# EAGLE schematic EEZ DIB SMX46 r1B5 (EAGLE 7.2.0)
ADIB
Assembly variants: Farnell, TME

## Sheet 1 of 3: DIB interface
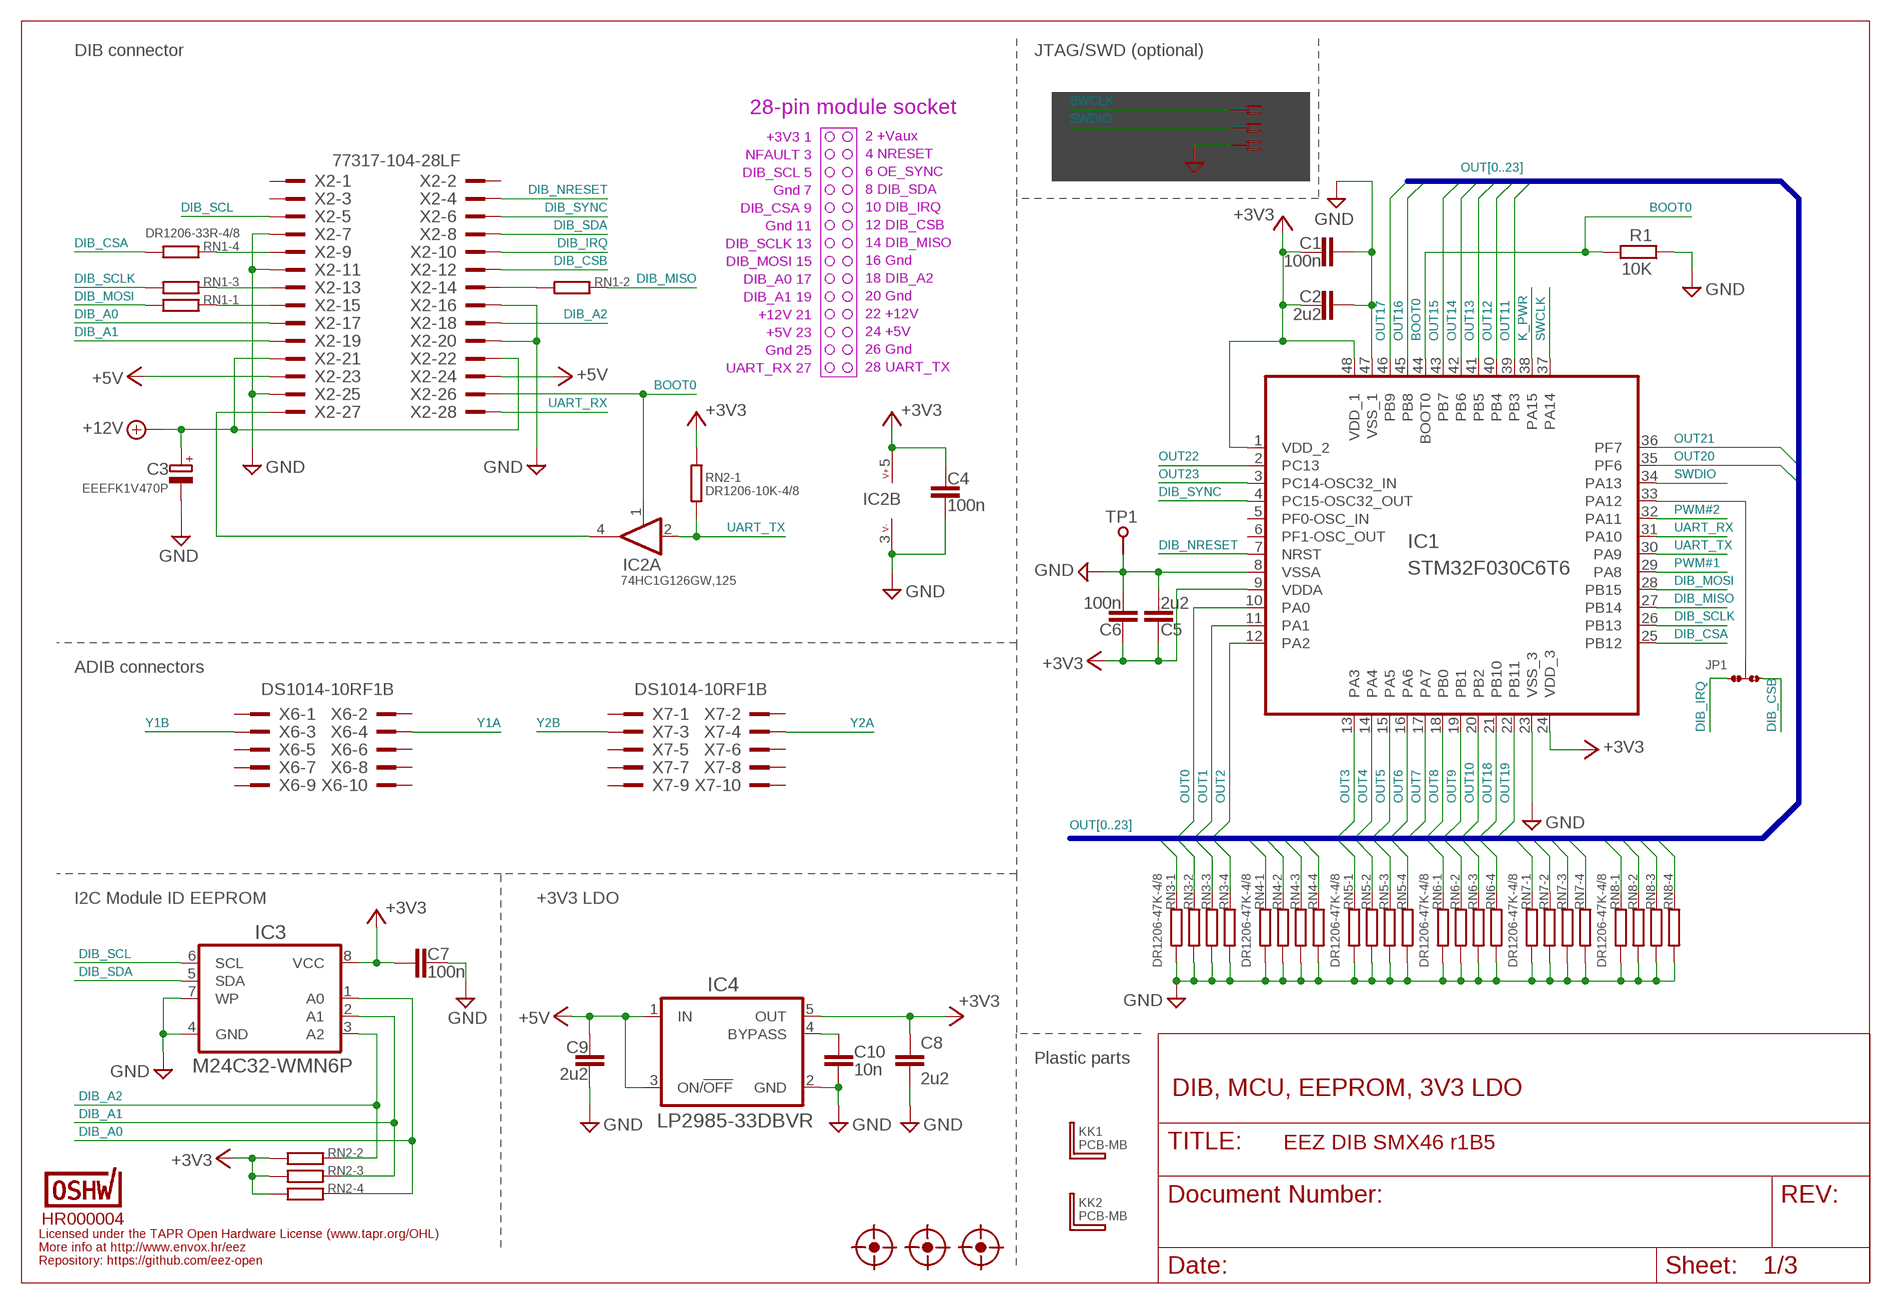
[diagram p0: schematic, sheet 1]

### Parts
C1  100n  C-EUC0603  [C0603]
C2  2u2  C-EUC0805  [C0805]
C3  EEEFK1V470P  ECAPPANASONIC_H  [CAPAE660X610N]
C4  100n  C-EUC0603  [C0603]
C5  2u2  C-EUC0805  [C0805]
C6  100n  C-EUC0603  [C0603]
C7  100n  C-EUC0603  [C0603]
C8  2u2  C-EUC0805  [C0805]
C9  2u2  C-EUC0805  [C0805]
C10  10n  C-EUC0805  [C0805]
FM1  FIDUCIAL_2  [FIDUCIAL_DUAL]
FM2  FIDUCIAL_2  [FIDUCIAL_DUAL]
FM3  FIDUCIAL_2  [FIDUCIAL_DUAL]
IC1  STM32F030C6T6  [LQFP-48]
IC2  74HC1G126GW,125  [SOT65P210X110-5N]
IC3  M24C32-WMN6P  AT24CXXSOIC8  [SOIC127P600X173-8N]
IC4  LP2985-33DBVR  LP2985  [SOT95P270X145-5N]
JP1  JP3-CUT-0805-ROTATED  [JP3-0805-CUT2]
KK1  PCB-MB  [PCB-MB]
KK2  PCB-MB  [PCB-MB]
R1  10K  R-EU_R0805  [R0805]
RN1  DR1206-33R-4/8  R_ARRAY4  [CAY16]
RN2  DR1206-10K-4/8  R_ARRAY4  [CAY16]
RN3  DR1206-47K-4/8  R_ARRAY4  [CAY16]
RN4  DR1206-47K-4/8  R_ARRAY4  [CAY16]
RN5  DR1206-47K-4/8  R_ARRAY4  [CAY16]
RN6  DR1206-47K-4/8  R_ARRAY4  [CAY16]
RN7  DR1206-47K-4/8  R_ARRAY4  [CAY16]
RN8  DR1206-47K-4/8  R_ARRAY4  [CAY16]
TP1  PCB_TEST_TABSHIELD  [PCB_SHIELD_TAB]
U$3  HR000004  CERT-SMALL  [CERT-SMALL-SILK]
X1  N.C.  SSW-106-02-S-S  [SSW-106-02-S-S]
X2  77317-104-28LF  [77317-104-28LF]
X6  DS1014-10RF1B  [DS1014-10RF1B]
X7  DS1014-10RF1B  [DS1014-10RF1B]

### Nets
+3V3: C1.2 C2.1 C4.1 C5.2 C6.1 C7.2 C8.1 IC1.1(VDD_2) IC1.9(VDDA) IC1.24(VDD_3) IC1.48(VDD_1) IC2.5(B:V+) IC3.8(VCC) IC4.5(OUT) RN2.5 RN2.6 RN2.7 RN2.8 ; also sheet 2
+5V: C9.2 IC4.1(IN) IC4.3(ON/!OFF) X2.23 X2.24 ; also sheet 2
+12V: C3.1(+) X2.21 X2.22 ; also sheet 2,3
BOOT0: IC1.44(BOOT0) IC2.1(A:EN) R1.2 X2.26
DIB_A0: IC3.1(A0) RN2.4 X2.17
DIB_A1: IC3.2(A1) RN2.3 X2.19
DIB_A2: IC3.3(A2) RN2.2 X2.18
DIB_CSA: IC1.25(PB12) RN1.4
DIB_CSB: JP1.NO X2.12
DIB_IRQ: JP1.NC X2.10
DIB_MISO: IC1.27(PB14) RN1.2
DIB_MOSI: IC1.28(PB15) RN1.1
DIB_NRESET: IC1.7(NRST) X2.4
DIB_SCL: IC3.6(SCL) X2.5
DIB_SCLK: IC1.26(PB13) RN1.3
DIB_SDA: IC3.5(SDA) X2.8
DIB_SYNC: IC1.4(PC15-OSC32_OUT) X2.6
GND: C1.1 C2.2 C3.2(-) C4.2 C5.1 C6.2 C7.1 C8.2 C9.1 C10.1 IC1.8(VSSA) IC1.23(VSS_3) IC1.47(VSS_1) IC2.3(B:V-) IC3.4(GND) IC3.7(WP) IC4.2(GND) R1.1 RN3.1 RN3.2 RN3.3 RN3.4 RN4.1 RN4.2 RN4.3 RN4.4 RN5.1 RN5.2 RN5.3 RN5.4 RN6.1 RN6.2 RN6.3 RN6.4 RN7.3 RN7.4 RN7.7 RN7.8 RN8.3 RN8.4 RN8.7 RN8.8 TP1.1 X1.3 X2.7 X2.11 X2.16 X2.20 X2.25 ; also sheet 2,3
K_PWR: IC1.38(PA15) ; also sheet 2
N$69: RN1.5 X2.9
N$70: C10.2 IC4.4(BYPASS)
N$72: IC2.4(A:O) X2.27
N$75: IC1.33(PA12) JP1.COM
N$99: RN1.6 X2.13
N$101: RN1.7 X2.14
N$102: RN1.8 X2.15
OUT0: IC1.10(PA0) RN3.8 ; also sheet 3
OUT1: IC1.11(PA1) RN3.7 ; also sheet 3
OUT2: IC1.12(PA2) RN6.8 ; also sheet 3
OUT3: IC1.13(PA3) RN6.7 ; also sheet 3
OUT4: IC1.14(PA4) RN3.5 ; also sheet 3
OUT5: IC1.15(PA5) RN3.6 ; also sheet 3
OUT6: IC1.16(PA6) RN6.5 ; also sheet 3
OUT7: IC1.17(PA7) RN6.6 ; also sheet 3
OUT8: IC1.18(PB0) RN4.7 ; also sheet 3
OUT9: IC1.19(PB1) RN4.8 ; also sheet 3
OUT10: IC1.20(PB2) RN7.6 ; also sheet 3
OUT11: IC1.39(PB3) RN7.5 ; also sheet 3
OUT12: IC1.40(PB4) RN4.5 ; also sheet 3
OUT13: IC1.41(PB5) RN4.6 ; also sheet 3
OUT14: IC1.42(PB6) RN7.2 ; also sheet 3
OUT15: IC1.43(PB7) RN7.1 ; also sheet 3
OUT16: IC1.45(PB8) RN5.7 ; also sheet 3
OUT17: IC1.46(PB9) RN5.8 ; also sheet 3
OUT18: IC1.21(PB10) RN8.5 ; also sheet 3
OUT19: IC1.22(PB11) RN8.6 ; also sheet 3
OUT20: IC1.35(PF6) RN5.5 ; also sheet 3
OUT21: IC1.36(PF7) RN5.6 ; also sheet 3
OUT22: IC1.2(PC13) RN8.1 ; also sheet 3
OUT23: IC1.3(PC14-OSC32_IN) RN8.2 ; also sheet 3
PWM#1: IC1.29(PA8) ; also sheet 2
PWM#2: IC1.32(PA11) ; also sheet 2
SWCLK: IC1.37(PA14) X1.2
SWDIO: IC1.34(PA13) X1.4
UART_RX: IC1.31(PA10) X2.28
UART_TX: IC1.30(PA9) IC2.2(A:I) RN2.1
Y1A: X6.4 ; also sheet 2
Y1B: X6.3 ; also sheet 2
Y2A: X7.4 ; also sheet 2
Y2B: X7.3 ; also sheet 2
Unconnected: IC1.5(PF0-OSC_IN) IC1.6(PF1-OSC_OUT) X1.1 X1.5 X1.6 X2.1 X2.2 X2.3 X6.1 X6.2 X6.5 X6.6 X6.7 X6.8 X6.9 X6.10 X7.1 X7.2 X7.5 X7.6 X7.7 X7.8 X7.9 X7.10

### Buses
OUT[0..23]

### Notes on the sheet
- DIB connector | JTAG/SWD (optional)
- 28-pin module socket
- +3V3 1
- 2 +Vaux
- NFAULT 3
- 4 NRESET
- DIB_SCL 5
- 6 OE_SYNC
- Gnd 7
- 8 DIB_SDA
- DIB_CSA 9
- 10 DIB_IRQ
- Gnd 11
- 12 DIB_CSB
- DIB_SCLK 13
- 14 DIB_MISO
- DIB_MOSI 15
- 16 Gnd
- DIB_A0 17
- 18 DIB_A2
- DIB_A1 19
- 20 Gnd
- +12V 21
- 22 +12V
- +5V 23
- 24 +5V
- Gnd 25
- 26 Gnd
- UART_RX 27
- 28 UART_TX
- ADIB connectors
- I2C Module ID EEPROM | +3V3 LDO
- Plastic parts
- DIB, MCU, EEPROM, 3V3 LDO
- Licensed under the TAPR Open Hardware License (www.tapr.org/OHL)
- More info at http://www.envox.hr/eez
- Repository: https://github.com/eez-open

## Sheet 2 of 3
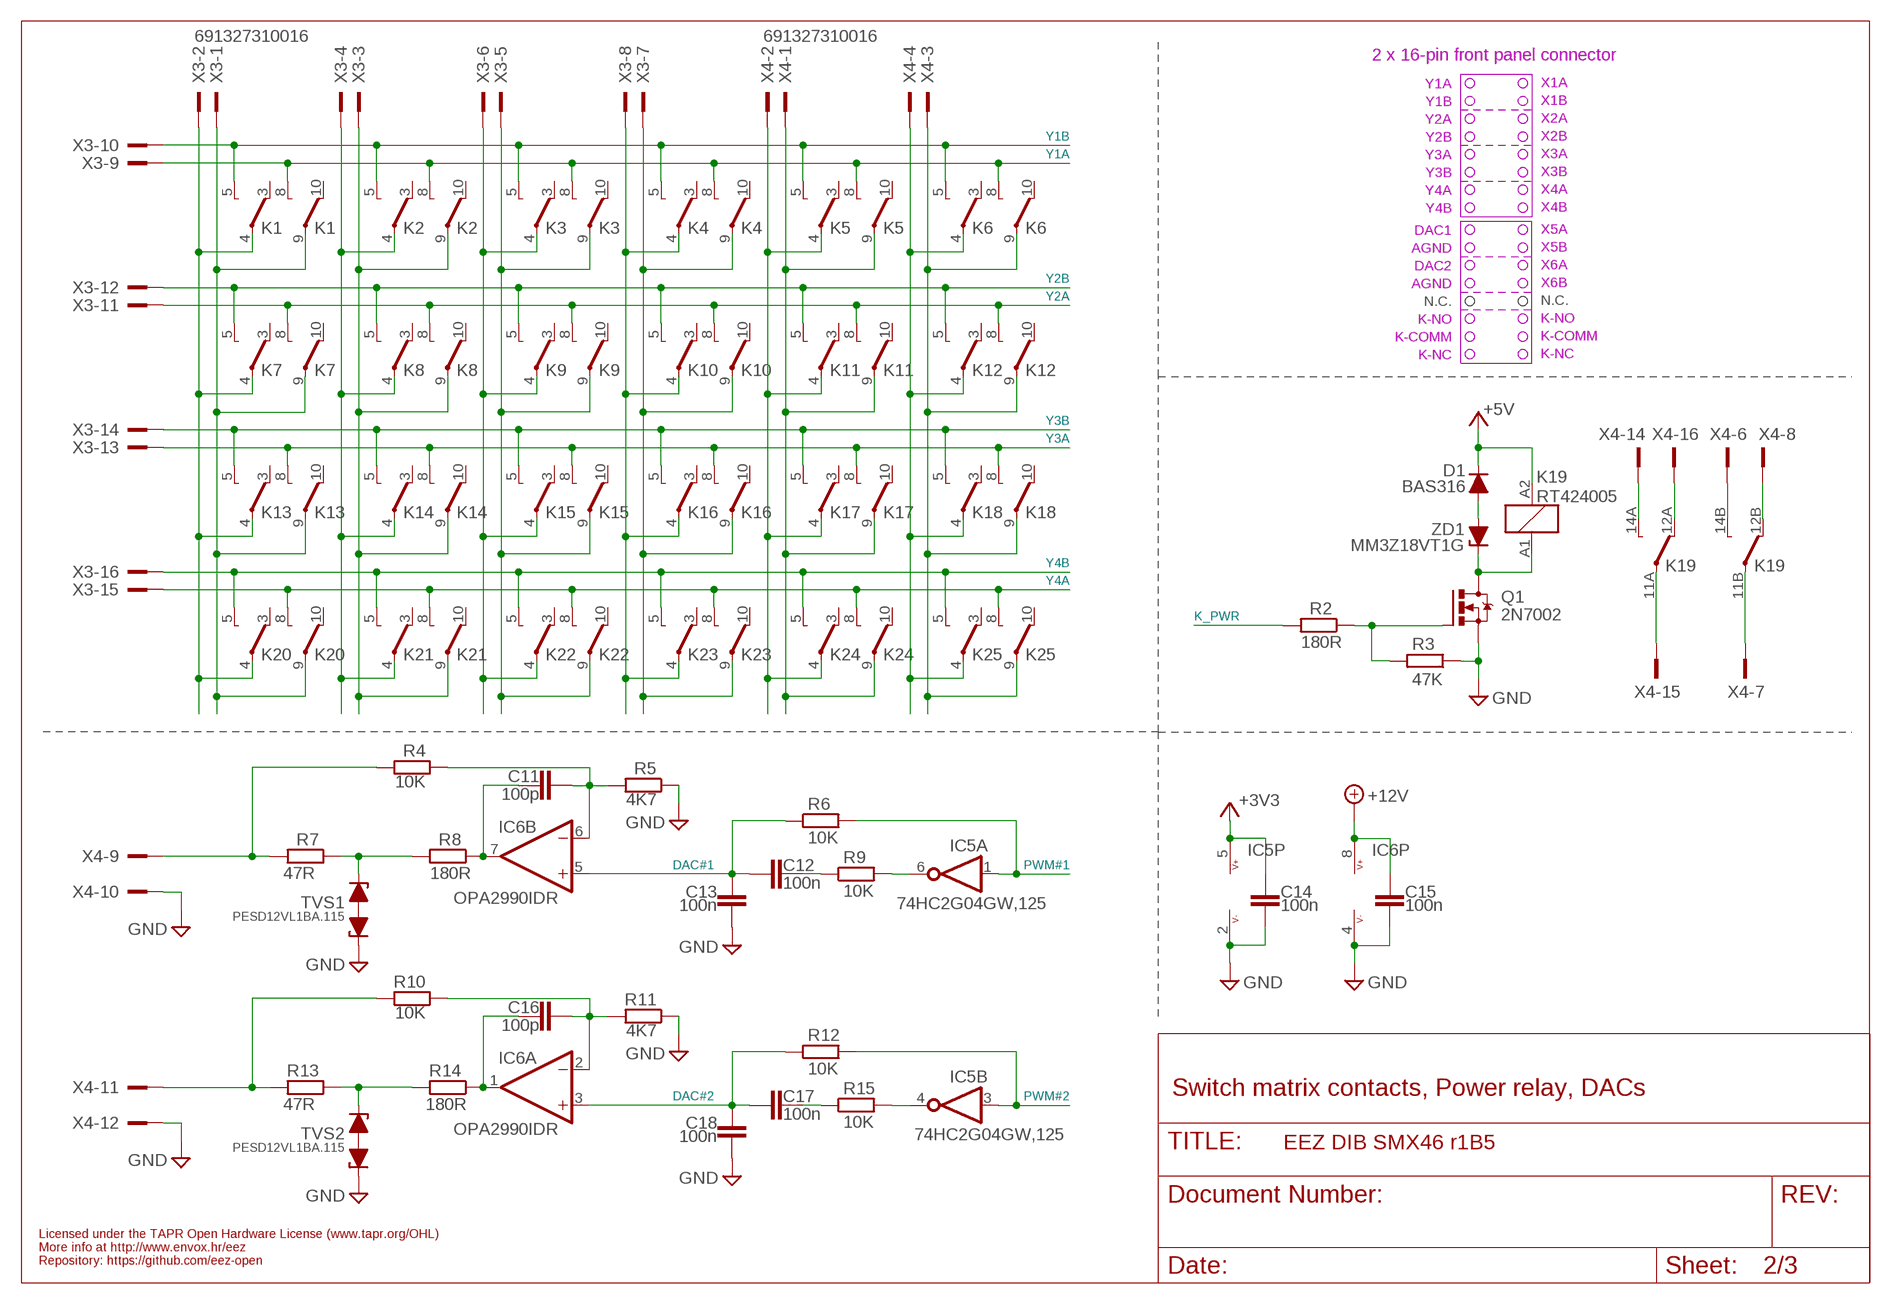
[diagram p1: schematic, sheet 2]

### Parts
C11  100p  C-EUC0805  [C0805]
C12  100n  C-EUC0603  [C0603]
C13  100n  C-EUC0603  [C0603]
C14  100n  C-EUC0603  [C0603]
C15  100n  C-EUC0603  [C0603]
C16  100p  C-EUC0805  [C0805]
C17  100n  C-EUC0603  [C0603]
C18  100n  C-EUC0603  [C0603]
D1  BAS316  DIODESOD323R  [SOD323-R]
IC5  74HC2G04GW,125  74HC2G04  [SOT65P210X110-6N]
IC6  OPA2990IDR  TL072SOIC8  [SOIC127P600X173-8N]
K1  FTR-C1GA012G-B05  FTR-C1  [FTR-C1]
K2  FTR-C1GA012G-B05  FTR-C1  [FTR-C1]
K3  FTR-C1GA012G-B05  FTR-C1  [FTR-C1]
K4  FTR-C1GA012G-B05  FTR-C1  [FTR-C1]
K5  FTR-C1GA012G-B05  FTR-C1  [FTR-C1]
K6  FTR-C1GA012G-B05  FTR-C1  [FTR-C1]
K7  FTR-C1GA012G-B05  FTR-C1  [FTR-C1]
K8  FTR-C1GA012G-B05  FTR-C1  [FTR-C1]
K9  FTR-C1GA012G-B05  FTR-C1  [FTR-C1]
K10  FTR-C1GA012G-B05  FTR-C1  [FTR-C1]
K11  FTR-C1GA012G-B05  FTR-C1  [FTR-C1]
K12  FTR-C1GA012G-B05  FTR-C1  [FTR-C1]
K13  FTR-C1GA012G-B05  FTR-C1  [FTR-C1]
K14  FTR-C1GA012G-B05  FTR-C1  [FTR-C1]
K15  FTR-C1GA012G-B05  FTR-C1  [FTR-C1]
K16  FTR-C1GA012G-B05  FTR-C1  [FTR-C1]
K17  FTR-C1GA012G-B05  FTR-C1  [FTR-C1]
K18  FTR-C1GA012G-B05  FTR-C1  [FTR-C1]
K19  RT424005  RELAY_RT314012-2  [RT-C/016A5_ROUND]
K20  FTR-C1GA012G-B05  FTR-C1  [FTR-C1]
K21  FTR-C1GA012G-B05  FTR-C1  [FTR-C1]
K22  FTR-C1GA012G-B05  FTR-C1  [FTR-C1]
K23  FTR-C1GA012G-B05  FTR-C1  [FTR-C1]
K24  FTR-C1GA012G-B05  FTR-C1  [FTR-C1]
K25  FTR-C1GA012G-B05  FTR-C1  [FTR-C1]
Q1  2N7002  [SOT103P240X110-3N]
R2  180R  R-EU_R0805  [R0805]
R3  47K  R-EU_R0805  [R0805]
R4  10K  R-EU_R0805  [R0805]
R5  4K7  R-EU_R0805  [R0805]
R6  10K  R-EU_R0805  [R0805]
R7  47R  R-EU_R0805  [R0805]
R8  180R  R-EU_R0805  [R0805]
R9  10K  R-EU_R0805  [R0805]
R10  10K  R-EU_R0805  [R0805]
R11  4K7  R-EU_R0805  [R0805]
R12  10K  R-EU_R0805  [R0805]
R13  47R  R-EU_R0805  [R0805]
R14  180R  R-EU_R0805  [R0805]
R15  10K  R-EU_R0805  [R0805]
TVS1  PESD12VL1BA.115  PESDXL1BA  [SOD323-BIDIR]
TVS2  PESD12VL1BA.115  PESDXL1BA  [SOD323-BIDIR]
X3  691327310016  [691327310016]
X4  691327310016  [691327310016]
ZD1  MM3Z18VT1G  ZENER-DIODESOD323R  [SOD323-R]

### Nets
+3V3: C14.1 IC5.5(P:V+) ; also sheet 1
+5V: D1.C K19.A2(K:C1) ; also sheet 1
+12V: C15.1 IC6.8(P:V+) ; also sheet 1,3
DAC#1: C12.1 C13.1 IC6.5(B:+IN) R6.1
DAC#2: C17.1 C18.1 IC6.3(A:+IN) R12.1
GND: C13.2 C14.2 C15.2 C18.2 IC5.2(P:V-) IC6.4(P:V-) Q1.2(S) R3.1 R5.1 R11.1 TVS1.1 TVS2.1 X4.10 X4.12 ; also sheet 1,3
ISET1: R7.1 R8.2 TVS1.2
ISET2: R13.1 R14.2 TVS2.2
K_PWR: R2.2 ; also sheet 1
N$1: K1.4(-1:P) K7.4(-1:P) K13.4(-1:P) K20.4(-1:P) X3.2
N$2: K1.9(-2:P) K7.9(-2:P) K13.9(-2:P) K20.9(-2:P) X3.1
N$12: K5.4(-1:P) K11.4(-1:P) K17.4(-1:P) K24.4(-1:P) X4.2
N$14: K2.4(-1:P) K8.4(-1:P) K14.4(-1:P) K21.4(-1:P) X3.4
N$15: K2.9(-2:P) K8.9(-2:P) K14.9(-2:P) K21.9(-2:P) X3.3
N$16: K5.9(-2:P) K11.9(-2:P) K17.9(-2:P) K24.9(-2:P) X4.1
N$17: K6.4(-1:P) K12.4(-1:P) K18.4(-1:P) K25.4(-1:P) X4.4
N$20: K6.9(-2:P) K12.9(-2:P) K18.9(-2:P) K25.9(-2:P) X4.3
N$24: K3.4(-1:P) K9.4(-1:P) K15.4(-1:P) K22.4(-1:P) X3.6
N$25: K3.9(-2:P) K9.9(-2:P) K15.9(-2:P) K22.9(-2:P) X3.5
N$34: K4.4(-1:P) K10.4(-1:P) K16.4(-1:P) K23.4(-1:P) X3.8
N$35: K4.9(-2:P) K10.9(-2:P) K16.9(-2:P) K23.9(-2:P) X3.7
N$68: R4.2 R7.2 X4.9
N$71: C17.2 R15.1
N$73: IC5.4(B:O) R15.2
N$74: C11.1 IC6.7(B:OUT) R8.1
N$76: C16.2 IC6.2(A:-IN) R10.1 R11.2
N$77: Q1.1(G) R2.1 R3.2
N$78: C16.1 IC6.1(A:OUT) R14.1
N$82: K19.11B(-2:P) X4.7
N$84: K19.12B(-2:S) X4.8
N$86: R10.2 R13.2 X4.11
N$94: K19.14B(-2:O) X4.6
N$95: K19.11A(-1:P) X4.15
N$96: K19.12A(-1:S) X4.16
N$97: K19.14A(-1:O) X4.14
N$98: D1.A ZD1.A
N$100: K19.A1(K:C2) Q1.3(D) ZD1.C
N$246: C12.2 R9.1
N$251: C11.2 IC6.6(B:-IN) R4.1 R5.2
N$252: IC5.6(A:O) R9.2
PWM#1: IC5.1(A:I) R6.2 ; also sheet 1
PWM#2: IC5.3(B:I) R12.2 ; also sheet 1
Y1A: K1.8(-2:O) K2.8(-2:O) K3.8(-2:O) K4.8(-2:O) K5.8(-2:O) K6.8(-2:O) X3.9 ; also sheet 1
Y1B: K1.5(-1:O) K2.5(-1:O) K3.5(-1:O) K4.5(-1:O) K5.5(-1:O) K6.5(-1:O) X3.10 ; also sheet 1
Y2A: K7.8(-2:O) K8.8(-2:O) K9.8(-2:O) K10.8(-2:O) K11.8(-2:O) K12.8(-2:O) X3.11 ; also sheet 1
Y2B: K7.5(-1:O) K8.5(-1:O) K9.5(-1:O) K10.5(-1:O) K11.5(-1:O) K12.5(-1:O) X3.12 ; also sheet 1
Y3A: K13.8(-2:O) K14.8(-2:O) K15.8(-2:O) K16.8(-2:O) K17.8(-2:O) K18.8(-2:O) X3.13
Y3B: K13.5(-1:O) K14.5(-1:O) K15.5(-1:O) K16.5(-1:O) K17.5(-1:O) K18.5(-1:O) X3.14
Y4A: K20.8(-2:O) K21.8(-2:O) K22.8(-2:O) K23.8(-2:O) K24.8(-2:O) K25.8(-2:O) X3.15
Y4B: K20.5(-1:O) K21.5(-1:O) K22.5(-1:O) K23.5(-1:O) K24.5(-1:O) K25.5(-1:O) X3.16
Unconnected: K1.3(-1:S) K1.10(-2:S) K2.3(-1:S) K2.10(-2:S) K3.3(-1:S) K3.10(-2:S) K4.3(-1:S) K4.10(-2:S) K5.3(-1:S) K5.10(-2:S) K6.3(-1:S) K6.10(-2:S) K7.3(-1:S) K7.10(-2:S) K8.3(-1:S) K8.10(-2:S) K9.3(-1:S) K9.10(-2:S) K10.3(-1:S) K10.10(-2:S) K11.3(-1:S) K11.10(-2:S) K12.3(-1:S) K12.10(-2:S) K13.3(-1:S) K13.10(-2:S) K14.3(-1:S) K14.10(-2:S) K15.3(-1:S) K15.10(-2:S) K16.3(-1:S) K16.10(-2:S) K17.3(-1:S) K17.10(-2:S) K18.3(-1:S) K18.10(-2:S) K20.3(-1:S) K20.10(-2:S) K21.3(-1:S) K21.10(-2:S) K22.3(-1:S) K22.10(-2:S) K23.3(-1:S) K23.10(-2:S) K24.3(-1:S) K24.10(-2:S) K25.3(-1:S) K25.10(-2:S) X4.5 X4.13

### Notes on the sheet
- 2 x 16-pin front panel connector
- Y1A
- X1A
- Y1B
- X1B
- Y2A
- X2A
- Y2B
- X2B
- Y3A
- X3A
- Y3B
- X3B
- Y4A
- X4A
- Y4B
- X4B
- DAC1
- X5A
- AGND
- X5B
- DAC2
- X6A
- AGND
- X6B
- N.C.
- N.C.
- K-NO
- K-NO
- K-COMM
- K-COMM
- K-NC
- K-NC
- Switch matrix contacts, Power relay, DACs
- Licensed under the TAPR Open Hardware License (www.tapr.org/OHL)
- More info at http://www.envox.hr/eez
- Repository: https://github.com/eez-open

## Sheet 3 of 3
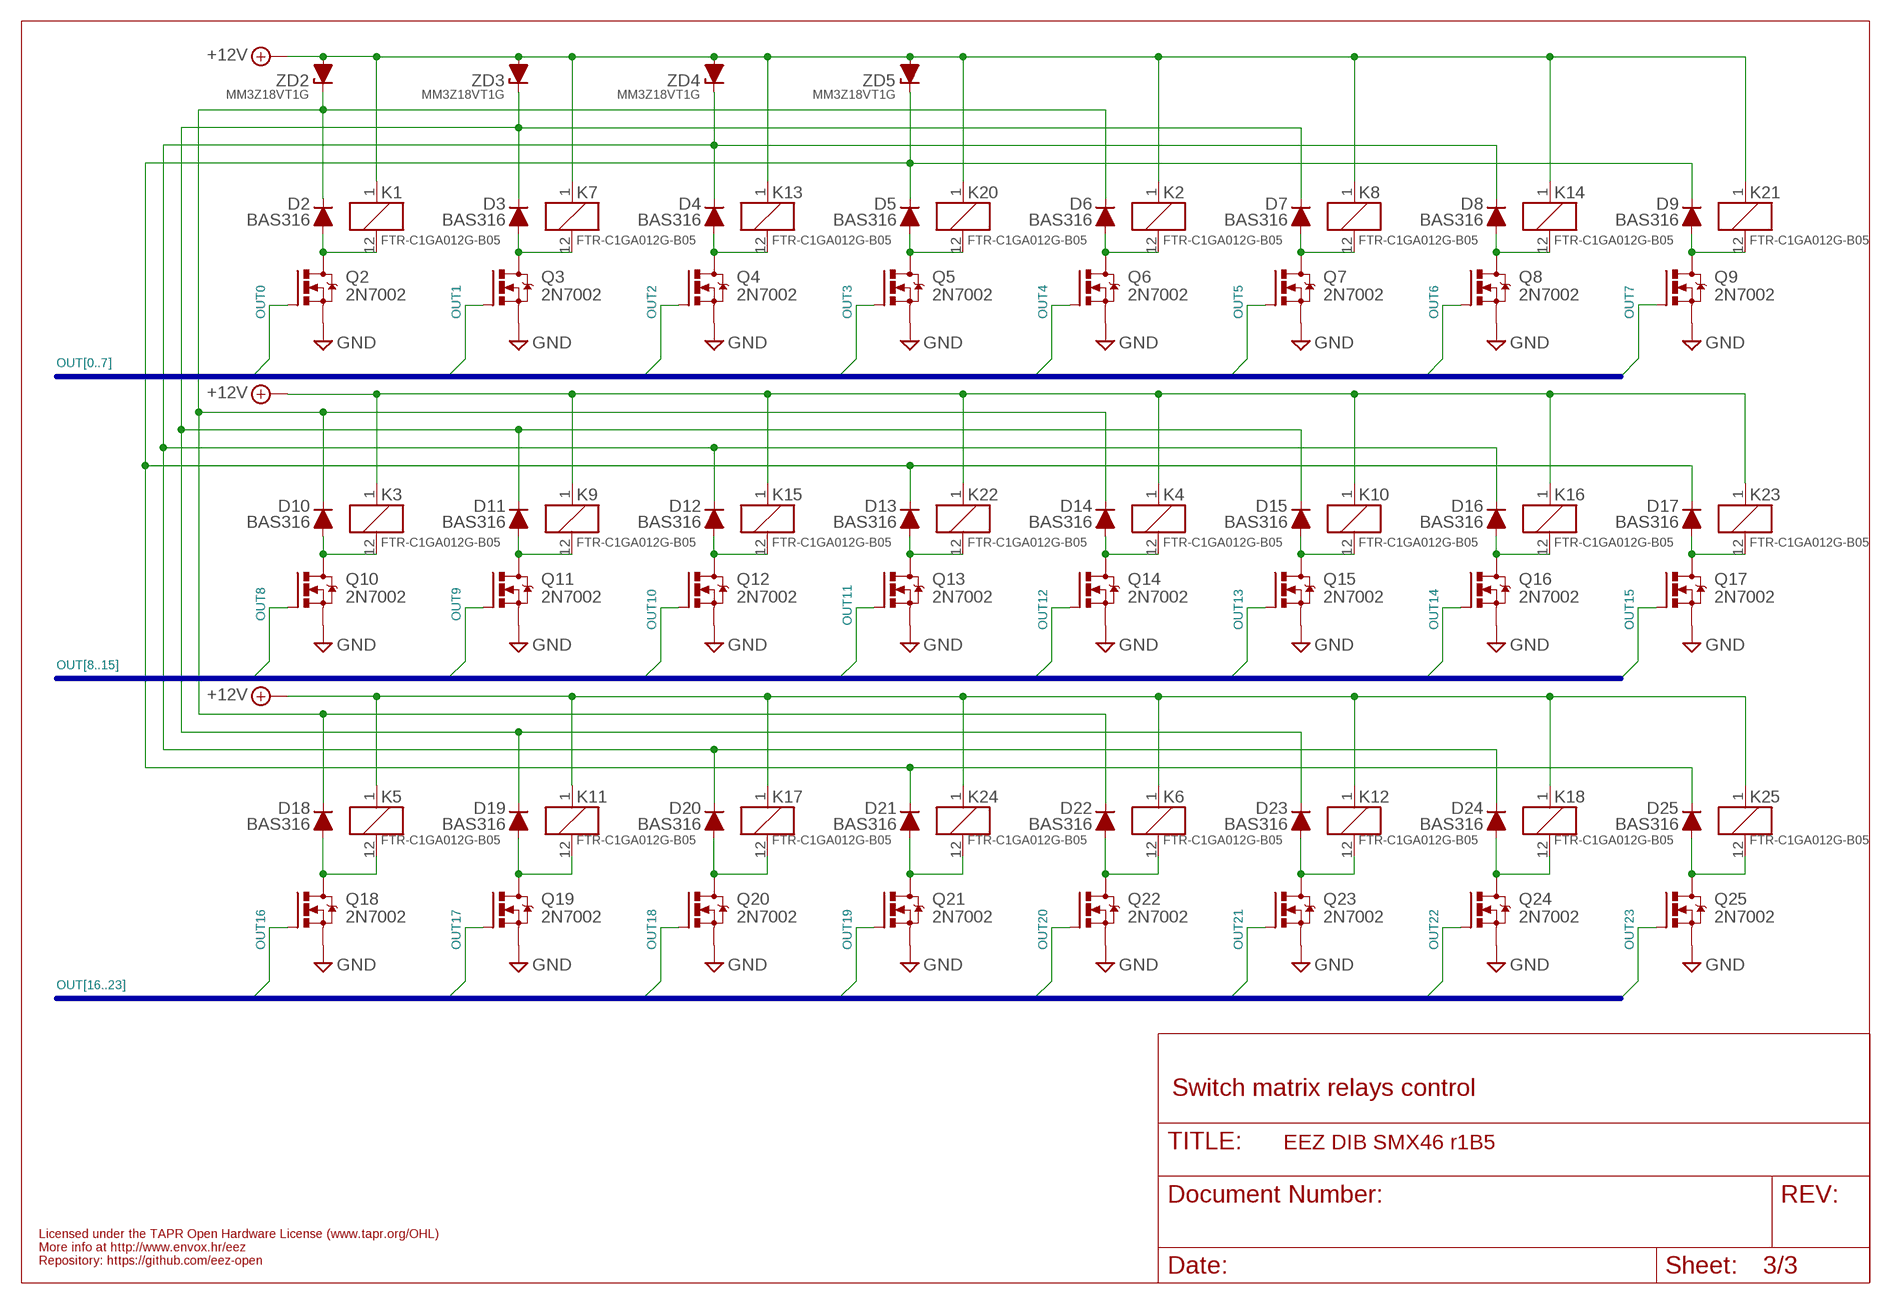
[diagram p2: schematic, sheet 3]

### Parts
D2  BAS316  DIODESOD323R  [SOD323-R]
D3  BAS316  DIODESOD323R  [SOD323-R]
D4  BAS316  DIODESOD323R  [SOD323-R]
D5  BAS316  DIODESOD323R  [SOD323-R]
D6  BAS316  DIODESOD323R  [SOD323-R]
D7  BAS316  DIODESOD323R  [SOD323-R]
D8  BAS316  DIODESOD323R  [SOD323-R]
D9  BAS316  DIODESOD323R  [SOD323-R]
D10  BAS316  DIODESOD323R  [SOD323-R]
D11  BAS316  DIODESOD323R  [SOD323-R]
D12  BAS316  DIODESOD323R  [SOD323-R]
D13  BAS316  DIODESOD323R  [SOD323-R]
D14  BAS316  DIODESOD323R  [SOD323-R]
D15  BAS316  DIODESOD323R  [SOD323-R]
D16  BAS316  DIODESOD323R  [SOD323-R]
D17  BAS316  DIODESOD323R  [SOD323-R]
D18  BAS316  DIODESOD323R  [SOD323-R]
D19  BAS316  DIODESOD323R  [SOD323-R]
D20  BAS316  DIODESOD323R  [SOD323-R]
D21  BAS316  DIODESOD323R  [SOD323-R]
D22  BAS316  DIODESOD323R  [SOD323-R]
D23  BAS316  DIODESOD323R  [SOD323-R]
D24  BAS316  DIODESOD323R  [SOD323-R]
D25  BAS316  DIODESOD323R  [SOD323-R]
Q2  2N7002  [SOT103P240X110-3N]
Q3  2N7002  [SOT103P240X110-3N]
Q4  2N7002  [SOT103P240X110-3N]
Q5  2N7002  [SOT103P240X110-3N]
Q6  2N7002  [SOT103P240X110-3N]
Q7  2N7002  [SOT103P240X110-3N]
Q8  2N7002  [SOT103P240X110-3N]
Q9  2N7002  [SOT103P240X110-3N]
Q10  2N7002  [SOT103P240X110-3N]
Q11  2N7002  [SOT103P240X110-3N]
Q12  2N7002  [SOT103P240X110-3N]
Q13  2N7002  [SOT103P240X110-3N]
Q14  2N7002  [SOT103P240X110-3N]
Q15  2N7002  [SOT103P240X110-3N]
Q16  2N7002  [SOT103P240X110-3N]
Q17  2N7002  [SOT103P240X110-3N]
Q18  2N7002  [SOT103P240X110-3N]
Q19  2N7002  [SOT103P240X110-3N]
Q20  2N7002  [SOT103P240X110-3N]
Q21  2N7002  [SOT103P240X110-3N]
Q22  2N7002  [SOT103P240X110-3N]
Q23  2N7002  [SOT103P240X110-3N]
Q24  2N7002  [SOT103P240X110-3N]
Q25  2N7002  [SOT103P240X110-3N]
ZD2  MM3Z18VT1G  ZENER-DIODESOD323R  [SOD323-R]
ZD3  MM3Z18VT1G  ZENER-DIODESOD323R  [SOD323-R]
ZD4  MM3Z18VT1G  ZENER-DIODESOD323R  [SOD323-R]
ZD5  MM3Z18VT1G  ZENER-DIODESOD323R  [SOD323-R]

### Nets
+12V: K1.1(C1) K2.1(C1) K3.1(C1) K4.1(C1) K5.1(C1) K6.1(C1) K7.1(C1) K8.1(C1) K9.1(C1) K10.1(C1) K11.1(C1) K12.1(C1) K13.1(C1) K14.1(C1) K15.1(C1) K16.1(C1) K17.1(C1) K18.1(C1) K20.1(C1) K21.1(C1) K22.1(C1) K23.1(C1) K24.1(C1) K25.1(C1) ZD2.A ZD3.A ZD4.A ZD5.A ; also sheet 1,2
GND: Q2.2(S) Q3.2(S) Q4.2(S) Q5.2(S) Q6.2(S) Q7.2(S) Q8.2(S) Q9.2(S) Q10.2(S) Q11.2(S) Q12.2(S) Q13.2(S) Q14.2(S) Q15.2(S) Q16.2(S) Q17.2(S) Q18.2(S) Q19.2(S) Q20.2(S) Q21.2(S) Q22.2(S) Q23.2(S) Q24.2(S) Q25.2(S) ; also sheet 1,2
N$4: D2.C D6.C D10.C D14.C D18.C D22.C ZD2.C
N$6: D3.C D7.C D11.C D15.C D19.C D23.C ZD3.C
N$7: D4.C D8.C D12.C D16.C D20.C D24.C ZD4.C
N$8: D5.C D9.C D13.C D17.C D21.C D25.C ZD5.C
N$9: D4.A K13.12(C2) Q4.3(D)
N$19: D8.A K14.12(C2) Q8.3(D)
N$21: D10.A K3.12(C2) Q10.3(D)
N$23: D9.A K21.12(C2) Q9.3(D)
N$27: D11.A K9.12(C2) Q11.3(D)
N$29: D7.A K8.12(C2) Q7.3(D)
N$31: D12.A K15.12(C2) Q12.3(D)
N$33: D6.A K2.12(C2) Q6.3(D)
N$37: D13.A K22.12(C2) Q13.3(D)
N$39: D3.A K7.12(C2) Q3.3(D)
N$41: D14.A K4.12(C2) Q14.3(D)
N$43: D2.A K1.12(C2) Q2.3(D)
N$45: D15.A K10.12(C2) Q15.3(D)
N$47: D5.A K20.12(C2) Q5.3(D)
N$49: D16.A K16.12(C2) Q16.3(D)
N$51: D17.A K23.12(C2) Q17.3(D)
N$53: D19.A K11.12(C2) Q19.3(D)
N$55: D20.A K17.12(C2) Q20.3(D)
N$57: D21.A K24.12(C2) Q21.3(D)
N$59: D22.A K6.12(C2) Q22.3(D)
N$61: D23.A K12.12(C2) Q23.3(D)
N$63: D18.A K5.12(C2) Q18.3(D)
N$65: D24.A K18.12(C2) Q24.3(D)
N$67: D25.A K25.12(C2) Q25.3(D)
OUT0: Q2.1(G) ; also sheet 1
OUT1: Q3.1(G) ; also sheet 1
OUT2: Q4.1(G) ; also sheet 1
OUT3: Q5.1(G) ; also sheet 1
OUT4: Q6.1(G) ; also sheet 1
OUT5: Q7.1(G) ; also sheet 1
OUT6: Q8.1(G) ; also sheet 1
OUT7: Q9.1(G) ; also sheet 1
OUT8: Q10.1(G) ; also sheet 1
OUT9: Q11.1(G) ; also sheet 1
OUT10: Q12.1(G) ; also sheet 1
OUT11: Q13.1(G) ; also sheet 1
OUT12: Q14.1(G) ; also sheet 1
OUT13: Q15.1(G) ; also sheet 1
OUT14: Q16.1(G) ; also sheet 1
OUT15: Q17.1(G) ; also sheet 1
OUT16: Q18.1(G) ; also sheet 1
OUT17: Q19.1(G) ; also sheet 1
OUT18: Q20.1(G) ; also sheet 1
OUT19: Q21.1(G) ; also sheet 1
OUT20: Q22.1(G) ; also sheet 1
OUT21: Q23.1(G) ; also sheet 1
OUT22: Q24.1(G) ; also sheet 1
OUT23: Q25.1(G) ; also sheet 1

### Buses
OUT[0..7]
OUT[8..15]
OUT[16..23]

### Notes on the sheet
- Switch matrix relays control
- Licensed under the TAPR Open Hardware License (www.tapr.org/OHL)
- More info at http://www.envox.hr/eez
- Repository: https://github.com/eez-open

## Library data of the parts
C1 C2 C4-C18 = rcl:C-EU: CAPACITOR, European symbol
C3 = EEZ_Lib1:ECAP
D1-D25 = EEZ_Lib1:DIODE
FM1-FM3 = EEZ_Lib1:FIDUCIAL: Fiducial mark for pick and place automation
IC1 = EEZ_DIB:STM32F030: Arm® 32-bit Cortex®-M0 CPU
IC2 = EEZ_Lib1:74HC1G126: Single Bus Buffer Gate With 3-State Outputs
IC3 = EEZ_Lib1:AT24CXX: I2C-Compatible (2-wire) Serial EEPROM
IC4 = EEZ_DIB:LP2985: 150-mA Low-noise Low-dropout Regulator With Shutdown
IC5 = EEZ_Lib1:74HC2G04: Dual inverter
IC6 = EEZ_Lib1:TL072
JP1 = EEZ_Lib1:JP3-CUT
K1-K18 K20-K25 = EEZ_Lib1:FTR-C1: Power relay, 2 poles, 2A high insulation/wide gap
K19 = EEZ_Lib1:RELAY_RT314012
KK1 KK2 = EEZ_Lib1:PCB-MB: Richo Mounting Block; 16 x 6 mm
Q1-Q25 = EEZ_Lib1:2N7002: N-CHANNEL ENHANCEMENT MODE FIELD EFFECT TRANSISTOR; MPN: 2N7002-7-F; OC_FARNELL: 1713823; OC_NEWARK: 25R5679; PACKAGE: SOT-23-3; SUPPLIER: DIODES INC.
R1-R15 = rcl:R-EU_: RESISTOR, European symbol
RN1-RN8 = EEZ_Lib1:R_ARRAY4: 1206 four resistor array
TP1 = EEZ_Lib1:PCB_TEST_TAB
TVS1 TVS2 = EEZ_Lib1:PESDXL1BA: Low capacitance bidirectional ESD protection diodes
U$3 = OSHWA:CERT
X1 = con-samtec:SSW-106-02-S-S: THROUGH-HOLE .025" SQ POST SOCKET Source: Samtec SSW.pdf; MPN: SSW-106-02-S-S; OC_FARNELL: unknown; OC_NEWARK: 11P9416
X2 = EEZ_connectors:77317-104-28LF: Headers & Wire Housings 28P right angle 0.1" pitch
X3 X4 = EEZ_connectors:691327310016: WR-TBL Serie 3273 – 3.81mm Close Horizontal Dual Row PCB Header, 16 Pins
X6 X7 = EEZ_connectors:DS1014-10RF1B: 10-pin IDC 2mm Socket; male; 90°; THT
ZD1-ZD5 = EEZ_Lib1:ZENER-DIODE

## Net classes
0 default: width 0.203 mm, drill 0.3 mm, clearance 0.203 mm
1 lvds: width 0.152 mm, drill 0.3 mm, clearance 0.152 mm to class 0, clearance 0.152 mm
2 gnd: width 0.254 mm, drill 0.584 mm, clearance 0.254 mm
3 diff_in: width 0.254 mm, drill 0.584 mm, clearance 0.203 mm to class 0, clearance 0.203 mm to class 1, clearance 0.203 mm to class 2, clearance 0.203 mm